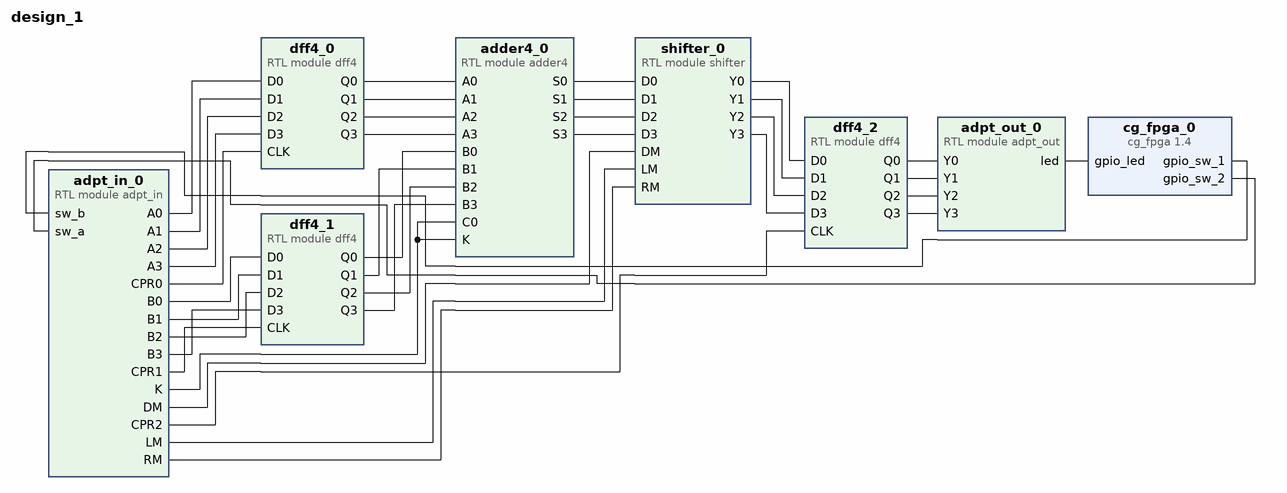
[diagram p0: block diagram of the top level]
# Vivado block design design_1, xc7z020clg400-1, Vivado 2024.2
create_bd_design design_1

create_bd_cell -type ip -vlnv educg.net:user:cg_fpga:1.4 cg_fpga_0
create_bd_cell -type module -reference adpt_in adpt_in_0
create_bd_cell -type module -reference dff4 dff4_0
create_bd_cell -type module -reference dff4 dff4_1
create_bd_cell -type module -reference shifter shifter_0
create_bd_cell -type module -reference adder4 adder4_0
create_bd_cell -type module -reference dff4 dff4_2
create_bd_cell -type module -reference adpt_out adpt_out_0

# ---- connections ----

connect_bd_net [get_bd_pins adder4_0/S0] [get_bd_pins shifter_0/D0]
connect_bd_net [get_bd_pins adder4_0/S1] [get_bd_pins shifter_0/D1]
connect_bd_net [get_bd_pins adder4_0/S2] [get_bd_pins shifter_0/D2]
connect_bd_net [get_bd_pins adder4_0/S3] [get_bd_pins shifter_0/D3]
connect_bd_net [get_bd_pins adpt_in_0/A0] [get_bd_pins dff4_0/D0]
connect_bd_net [get_bd_pins adpt_in_0/A1] [get_bd_pins dff4_0/D1]
connect_bd_net [get_bd_pins adpt_in_0/A2] [get_bd_pins dff4_0/D2]
connect_bd_net [get_bd_pins adpt_in_0/A3] [get_bd_pins dff4_0/D3]
connect_bd_net [get_bd_pins adpt_in_0/B0] [get_bd_pins dff4_1/D0]
connect_bd_net [get_bd_pins adpt_in_0/B1] [get_bd_pins dff4_1/D1]
connect_bd_net [get_bd_pins adpt_in_0/B2] [get_bd_pins dff4_1/D2]
connect_bd_net [get_bd_pins adpt_in_0/B3] [get_bd_pins dff4_1/D3]
connect_bd_net [get_bd_pins adpt_in_0/CPR0] [get_bd_pins dff4_0/CLK]
connect_bd_net [get_bd_pins adpt_in_0/CPR1] [get_bd_pins dff4_1/CLK]
connect_bd_net [get_bd_pins adpt_in_0/CPR2] [get_bd_pins dff4_2/CLK]
connect_bd_net [get_bd_pins adpt_in_0/DM] [get_bd_pins shifter_0/DM]
connect_bd_net [get_bd_pins adpt_in_0/K] [get_bd_pins adder4_0/K] [get_bd_pins adder4_0/C0]
connect_bd_net [get_bd_pins adpt_in_0/LM] [get_bd_pins shifter_0/LM]
connect_bd_net [get_bd_pins adpt_in_0/RM] [get_bd_pins shifter_0/RM]
connect_bd_net [get_bd_pins adpt_out_0/led] [get_bd_pins cg_fpga_0/gpio_led]
connect_bd_net [get_bd_pins cg_fpga_0/gpio_sw_1] [get_bd_pins adpt_in_0/sw_b]
connect_bd_net [get_bd_pins cg_fpga_0/gpio_sw_2] [get_bd_pins adpt_in_0/sw_a]
connect_bd_net [get_bd_pins dff4_0/Q0] [get_bd_pins adder4_0/A0]
connect_bd_net [get_bd_pins dff4_0/Q1] [get_bd_pins adder4_0/A1]
connect_bd_net [get_bd_pins dff4_0/Q2] [get_bd_pins adder4_0/A2]
connect_bd_net [get_bd_pins dff4_0/Q3] [get_bd_pins adder4_0/A3]
connect_bd_net [get_bd_pins dff4_1/Q0] [get_bd_pins adder4_0/B0]
connect_bd_net [get_bd_pins dff4_1/Q1] [get_bd_pins adder4_0/B1]
connect_bd_net [get_bd_pins dff4_1/Q2] [get_bd_pins adder4_0/B2]
connect_bd_net [get_bd_pins dff4_1/Q3] [get_bd_pins adder4_0/B3]
connect_bd_net [get_bd_pins dff4_2/Q0] [get_bd_pins adpt_out_0/Y0]
connect_bd_net [get_bd_pins dff4_2/Q1] [get_bd_pins adpt_out_0/Y1]
connect_bd_net [get_bd_pins dff4_2/Q2] [get_bd_pins adpt_out_0/Y2]
connect_bd_net [get_bd_pins dff4_2/Q3] [get_bd_pins adpt_out_0/Y3]
connect_bd_net [get_bd_pins shifter_0/Y0] [get_bd_pins dff4_2/D0]
connect_bd_net [get_bd_pins shifter_0/Y1] [get_bd_pins dff4_2/D1]
connect_bd_net [get_bd_pins shifter_0/Y2] [get_bd_pins dff4_2/D2]
connect_bd_net [get_bd_pins shifter_0/Y3] [get_bd_pins dff4_2/D3]

validate_bd_design
save_bd_design
